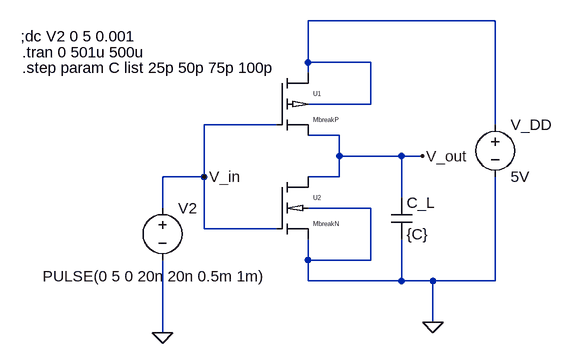
[diagram p0: schematic CMOSinverter_with_Capacitor.asc]
CMOSinverter_with_Capacitor.asc, the LTspice schematic file:
Version 4
SHEET 1 880 680
WIRE 480 -32 192 -32
WIRE 192 32 192 -32
WIRE 288 32 192 32
WIRE 192 48 192 32
WIRE 288 96 288 32
WIRE 288 96 192 96
WIRE 144 128 32 128
WIRE 480 128 480 -32
WIRE 240 144 192 144
WIRE 240 176 240 144
WIRE 336 176 240 176
WIRE 368 176 336 176
WIRE 32 208 32 128
WIRE 32 208 -32 208
WIRE 240 208 240 176
WIRE 240 208 192 208
WIRE 336 240 336 176
WIRE -32 256 -32 208
WIRE 288 256 192 256
WIRE 32 288 32 208
WIRE 144 288 32 288
WIRE 192 336 192 304
WIRE 288 336 288 256
WIRE 288 336 192 336
WIRE 192 368 192 336
WIRE 336 368 336 304
WIRE 336 368 192 368
WIRE 384 368 336 368
WIRE 480 368 480 208
WIRE 480 368 384 368
WIRE 384 432 384 368
WIRE -32 448 -32 336
FLAG -32 448 0
FLAG 368 176 V_out
FLAG 32 208 V_in
FLAG 384 432 0
SYMBOL advee_components\\MbreakN 144 208 R0
SYMATTR InstName U2
SYMBOL advee_components\\MbreakP 144 48 R0
SYMATTR InstName U1
SYMBOL voltage 480 112 R0
SYMATTR InstName V_DD
SYMATTR Value 5V
SYMBOL voltage -32 240 R0
WINDOW 3 -184 121 Left 2
WINDOW 123 0 0 Left 0
WINDOW 39 0 0 Left 0
SYMATTR InstName V2
SYMATTR Value PULSE(0 5 0 20n 20n 0.5m 1m)
SYMBOL cap 320 240 R0
SYMATTR InstName C_L
SYMATTR Value {C}
TEXT -250 -8 Left 2 !;dc V2 0 5 0.001
TEXT -248 16 Left 2 !.tran 0 501u 500u
TEXT -248 40 Left 2 !.step param C list 25p 50p 75p 100p

The netlist it stands for:
* CMOSinverter_with_Capacitor.asc
XU2 V_out V_in 0 0 MbreakN  ; pins D G S B
XU1 N001 V_in V_out N001 MbreakP  ; pins D G S B
V_DD N001 0 5V
V2 V_in 0 PULSE(0 5 0 20n 20n 0.5m 1m)
C_L V_out 0 {C}
;dc V2 0 5 0.001
.tran 0 501u 500u
.step param C list 25p 50p 75p 100p
.lib AdvEE_Components.lib
.backanno
.end